# Altium schematic sheet Power_Module.SchDoc
size A
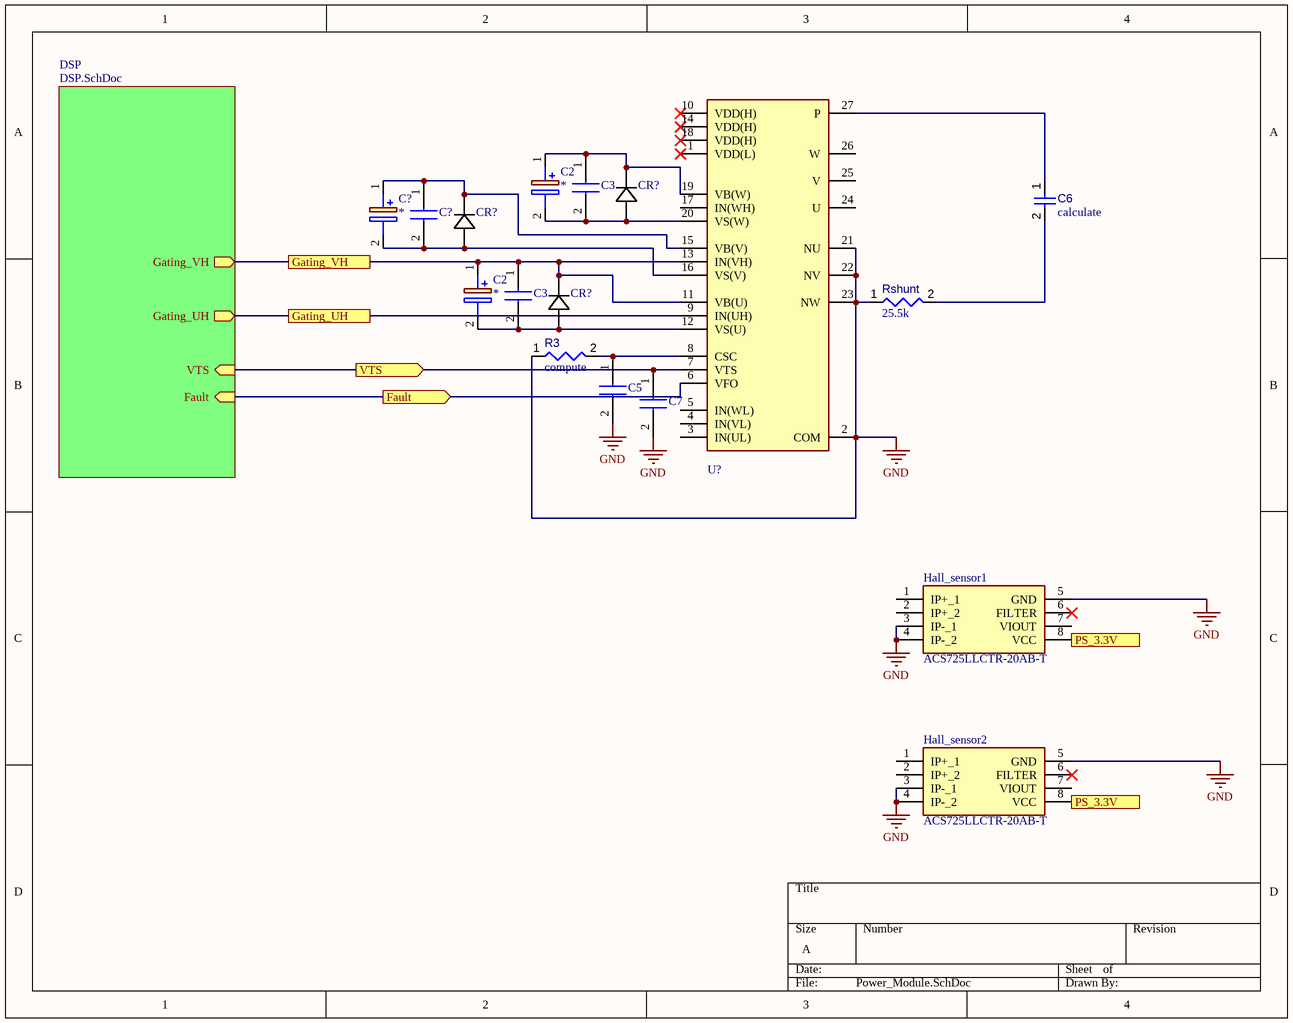
[diagram p0: Power_Module.SchDoc]

## Parts
(Parts that share a designator on the sheet are numbered #1, #2 ... from top to bottom, then left to right.)
C2#1  *  [CAPPRD350W65D800H1650]
C2#2  *  [CAPPRD350W65D800H1650]
C3#1  C340C105K1R5TA  [C340C105K1R5TA]  (value not drawn)
C3#2  C340C105K1R5TA  [C340C105K1R5TA]  (value not drawn)
C5  C340C105K1R5TA  [C340C105K1R5TA]  (value not drawn)
C6  value calculate  [CAPC2013X145X50ML20T25]  (hidden comment: Capacitor 1 uF +/- 10% 25 V 0805)
C7  C340C105K1R5TA  [C340C105K1R5TA]  (value not drawn)
C?#1  *  [CAPPRD350W65D800H1650]
C?#2  C340C105K1R5TA  [C340C105K1R5TA]  (value not drawn)
CR?#1  (no value)  [P6KESeries]
CR?#2  (no value)  [P6KESeries]
CR?#3  (no value)  [P6KESeries]
Hall_sensor1  ACS725LLCTR-20AB-T  [SOT127P600X175-8N]
Hall_sensor2  ACS725LLCTR-20AB-T  [SOT127P600X175-8N]
R3  value compute  [RESC0402(1005)_L]  (hidden comment: Resistor 25K5 +/-1 % 0402 63 mW)
Rshunt  value 25.5k  [RESC0402(1005)_L]  (hidden comment: Resistor 25K5 +/-1 % 0402 63 mW)
U?  FNB34060T  [FNB34060T]  (value not drawn)

## Sub-sheets
DSP = DSP.SchDoc: VTS (in), Fault (in), Gating_UH (out), Gating_VH (out)

## Ports
Fault (out), Gating_UH, Gating_VH, PS_3.3V (in), VTS (out)

## Nets
GND: C5.2 C7.2 Hall_sensor1.3(IP-_1) Hall_sensor1.4(IP-_2) Hall_sensor1.5(GND) Hall_sensor2.3(IP-_1) Hall_sensor2.4(IP-_2) Hall_sensor2.5(GND) R3.1 Rshunt.1 U?.2(COM) U?.21(NU) U?.22(NV) U?.23(NW)
Fault: U?.6(VFO) ; port Fault, sheet DSP/Fault
Gating_UH: U?.9(IN(UH)) ; port Gating_UH, sheet DSP/Gating_UH
Gating_VH: C2#2.1(+) C3#2.1 CR?#3.1 U?.11(VB(U)) U?.13(IN(VH)) ; port Gating_VH, sheet DSP/Gating_VH
PS_3.3V: Hall_sensor1.8(VCC) Hall_sensor2.8(VCC) ; port PS_3.3V
VTS: C7.1 U?.7(VTS) ; port VTS, sheet DSP/VTS
NetC2#1_1: C2#1.1(+) C3#1.1 CR?#1.1 U?.19(VB(W))
NetC2#1_2: C2#1.2(-) C3#1.2 CR?#1.2 U?.20(VS(W))
NetC2#2_2: C2#2.2(-) C3#2.2 CR?#3.2 U?.12(VS(U))
NetC5_1: C5.1 R3.2 U?.8(CSC)
NetC6_1: C6.1 U?.27(P)
NetC6_2: C6.2 Rshunt.2
NetC?#1_1: C?#1.1(+) C?#2.1 CR?#2.1 U?.15(VB(V))
NetC?#1_2: C?#1.2(-) C?#2.2 CR?#2.2 U?.16(VS(V))

Not connected (* = marked no-connect by the designer): Hall_sensor1 1(IP+_1) 2(IP+_2) 6(FILTER)* 7(VIOUT); Hall_sensor2 1(IP+_1) 2(IP+_2) 6(FILTER)* 7(VIOUT); U? 1(VDD(L))* 3(IN(UL)) 4(IN(VL)) 5(IN(WL)) 10(VDD(H))* 14(VDD(H))* 17(IN(WH)) 18(VDD(H))* 24(U) 25(V) 26(W)

## Library data of the parts
C2#1 C2#2 C?#1 = EEU-FS2A470: Capacitor Polarised; Manufacturer_Name: Panasonic; Datasheet Link: https://componentsearchengine.com/Datasheets/1/EEU-FS2A470.pdf; Height: 16.5mm; Manufacturer_Part_Number: EEU-FS2A470; Mouser Part Number: 667-EEU-FS2A470; Mouser Price/Stock: https://www.mouser.co.uk/ProductDetail/Panasonic/EEU-FS2A470?qs=w%2Fv1CP2dgqrDlaRaE647gA%3D%3D; Arrow Part Number: EEU-FS2A470; Arrow Price/Stock: https://www.arrow.com/en/products/eeu-fs2a470/panasonic
C3#1 C3#2 C5 C7 C?#2 = C340C105K1R5TA: Capacitor; Manufacturer_Name: Kemet; Datasheet Link: https://connect.kemet.com:7667/gateway/IntelliData-ComponentDocumentation/1.0/download/specsheet/C340C105K1R5TA; Height: 11.68mm; Manufacturer_Part_Number: C340C105K1R5TA; Mouser Part Number: 80-C340C105K1R; Mouser Price/Stock: https://www.mouser.com/Search/Refine.aspx?Keyword=80-C340C105K1R; Arrow Part Number: C340C105K1R5TA; Arrow Price/Stock: https://www.arrow.com/en/products/c340c105k1r5ta/kemet-corporation
C6 = CMP-001-00010-6: Chip Capacitor, 1 uF, +/-10%, 25 V, 0805 (2012 Metric); Capacitor Type: Ceramic; Voltage Rating: 25V; RoHS Compliant: True; Pins: 2; Mounting Technology: SM; Max Operating Temperature: 125°C; Min Operating Temperature: -55°C; Tolerance: 10%; Case/Package: 0805
CR?#1-CR?#3 = P6KE91A: No Description Available; Vendor: Littelfuse Inc; Built_By: EMA_UL_Team; Type: DEV; Manufacturer_Part_Number: P6KE91A; Copyright: Copyright (C) 2018 Accelerated Designs. All rights reserved; RefDes: RefDes; Value: Value
Hall_sensor1 Hall_sensor2 = ACS725LLCTR-20AB-T: Integrated Circuit; Manufacturer_Name: Allegro Microsystems; Datasheet Link: https://www.allegromicro.com/~/media/Files/Datasheets/ACS725-Datasheet.ashx; Height: 1.75mm; Manufacturer_Part_Number: ACS725LLCTR-20AB-T; Arrow Part Number: ACS725LLCTR-20AB-T; Arrow Price/Stock: https://www.arrow.com/en/products/acs725llctr-20ab-t/allegro-microsystems
R3 Rshunt = CMP-009-00171-3: Chip Resistor, 25,5 kOhms, +/-1 %, 63 mW, -55 to 155 degC, 0402; Tolerance: 1%; Power: 63mW; Case/Package: 0402; Min Operating Temperature: -55°C; Max Operating Temperature: 155°C; Pins: 2